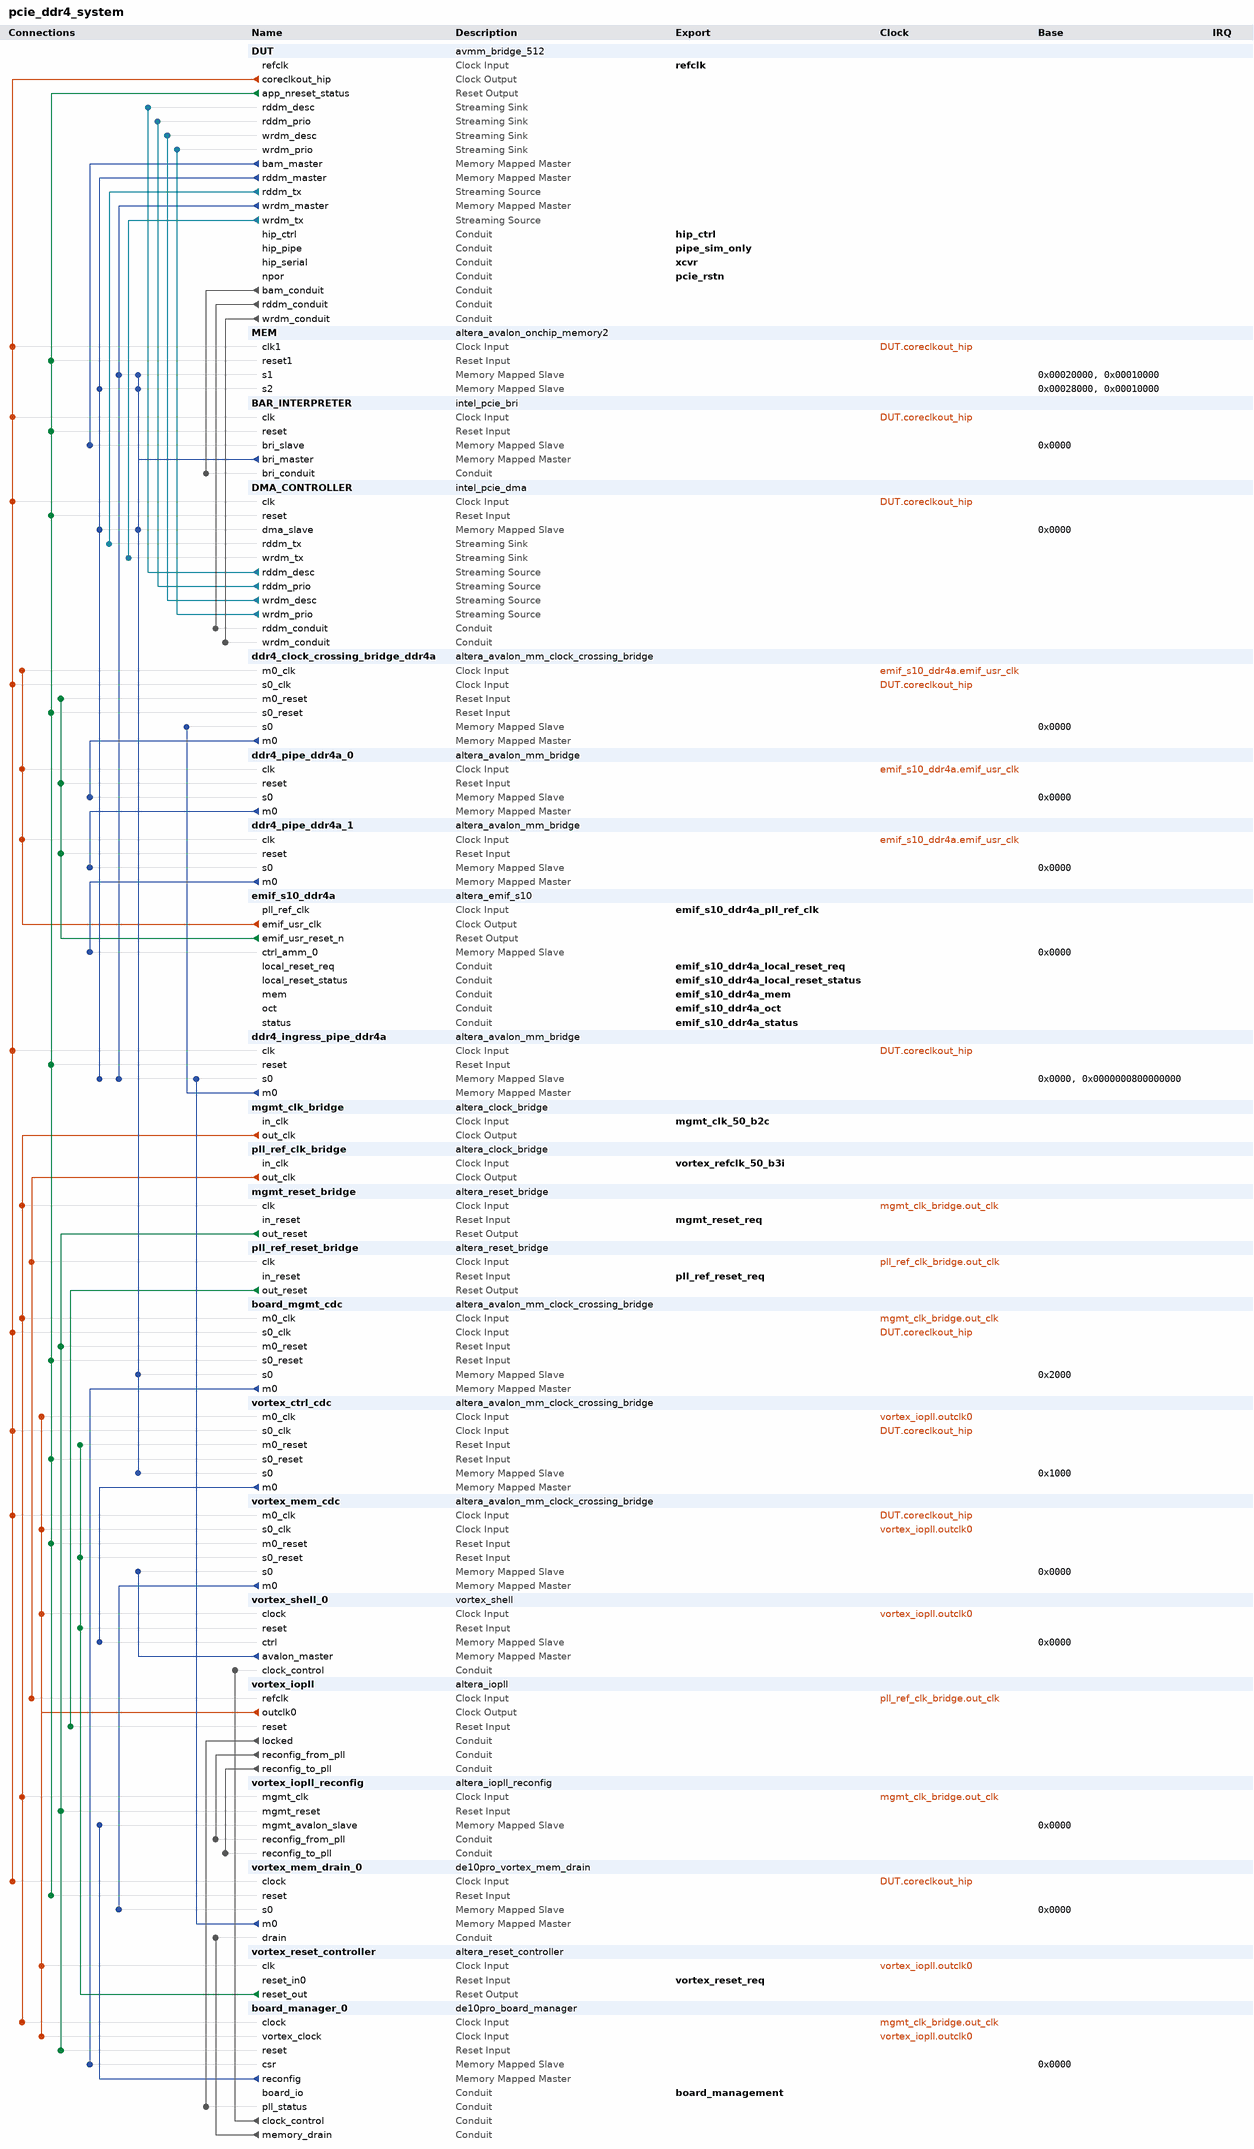
[diagram p0: system contents]
# Platform Designer (Qsys) system pcie_ddr4_system, Stratix 10 1SG280HU1F50E1VG
# Parameters at their usual value, and those the tool derives, are not listed.
package require -exact qsys 1.0
create_system pcie_ddr4_system
set_project_property DEVICE_FAMILY {Stratix 10}
set_project_property DEVICE 1SG280HU1F50E1VG

add_component DUT ip/pcie_example_design/pcie_example_design_DUT.ip avmm_bridge_512 DUT 19.1

add_component MEM ip/pcie_example_design/pcie_example_design_MEM.ip altera_avalon_onchip_memory2 MEM 19.1

add_component BAR_INTERPRETER ip/pcie_example_design/pcie_example_design_BAR_INTERPRETER.ip intel_pcie_bri BAR_INTERPRETER 19.1

add_component DMA_CONTROLLER ip/pcie_example_design/pcie_example_design_DMA_CONTROLLER.ip intel_pcie_dma DMA_CONTROLLER 19.1

add_component ddr4_clock_crossing_bridge_ddr4a ip/pcie_example_design/ddr4_clock_crossing_bridge.ip altera_avalon_mm_clock_crossing_bridge ddr4_clock_crossing_bridge_ddr4a 19.1

add_component ddr4_pipe_ddr4a_0 ip/pcie_example_design/ddr4_pipe.ip altera_avalon_mm_bridge ddr4_pipe_ddr4a_0 19.1

add_component ddr4_pipe_ddr4a_1 ip/pcie_example_design/ddr4_pipe.ip altera_avalon_mm_bridge ddr4_pipe_ddr4a_1 19.1

add_component emif_s10_ddr4a ip/pcie_example_design/emif_s10_ddr4a.ip altera_emif_s10 emif_s10_ddr4a 19.1.0

add_component ddr4_ingress_pipe_ddr4a ip/pcie_ddr4_system/pcie_ddr4_system_ddr4_ingress_pipe_ddr4a.ip altera_avalon_mm_bridge ddr4_ingress_pipe_ddr4a 19.1
load_component ddr4_ingress_pipe_ddr4a
set_component_parameter_value DATA_WIDTH 512
set_component_parameter_value ADDRESS_WIDTH 33
set_component_parameter_value USE_AUTO_ADDRESS_WIDTH 0
set_component_parameter_value ADDRESS_UNITS SYMBOLS
set_component_parameter_value MAX_BURST_SIZE 16
set_component_parameter_value MAX_PENDING_RESPONSES 128
set_component_parameter_value PIPELINE_RESPONSE 0
set_component_parameter_value SYNC_RESET 0
save_component

add_component mgmt_clk_bridge ip/pcie_ddr4_system/pcie_ddr4_system_mgmt_clk_bridge.ip altera_clock_bridge mgmt_clk_bridge 19.1
load_component mgmt_clk_bridge
set_component_parameter_value DERIVED_CLOCK_RATE 0
set_component_parameter_value EXPLICIT_CLOCK_RATE 50000000
save_component

add_component pll_ref_clk_bridge ip/pcie_ddr4_system/pcie_ddr4_system_pll_ref_clk_bridge.ip altera_clock_bridge pll_ref_clk_bridge 19.1
load_component pll_ref_clk_bridge
set_component_parameter_value DERIVED_CLOCK_RATE 0
set_component_parameter_value EXPLICIT_CLOCK_RATE 50000000
save_component

add_component mgmt_reset_bridge ip/pcie_ddr4_system/pcie_ddr4_system_mgmt_reset_bridge.ip altera_reset_bridge mgmt_reset_bridge 19.1
load_component mgmt_reset_bridge
set_component_parameter_value ACTIVE_LOW_RESET 0
set_component_parameter_value SYNCHRONOUS_EDGES deassert
set_component_parameter_value SYNC_RESET 0
save_component

add_component pll_ref_reset_bridge ip/pcie_ddr4_system/pcie_ddr4_system_pll_ref_reset_bridge.ip altera_reset_bridge pll_ref_reset_bridge 19.1
load_component pll_ref_reset_bridge
set_component_parameter_value ACTIVE_LOW_RESET 0
set_component_parameter_value SYNCHRONOUS_EDGES deassert
set_component_parameter_value SYNC_RESET 0
save_component

add_component board_mgmt_cdc ip/pcie_ddr4_system/pcie_ddr4_system_board_mgmt_cdc.ip altera_avalon_mm_clock_crossing_bridge board_mgmt_cdc 19.1
load_component board_mgmt_cdc
set_component_parameter_value DATA_WIDTH 32
set_component_parameter_value ADDRESS_WIDTH 8
set_component_parameter_value USE_AUTO_ADDRESS_WIDTH 0
set_component_parameter_value MAX_BURST_SIZE 1
set_component_parameter_value COMMAND_FIFO_DEPTH 4
set_component_parameter_value RESPONSE_FIFO_DEPTH 4
set_component_parameter_value MASTER_SYNC_DEPTH 2
set_component_parameter_value SLAVE_SYNC_DEPTH 2
set_component_parameter_value SYNC_RESET 0
save_component

add_component vortex_ctrl_cdc ip/pcie_ddr4_system/pcie_ddr4_system_vortex_ctrl_cdc.ip altera_avalon_mm_clock_crossing_bridge vortex_ctrl_cdc 19.1
load_component vortex_ctrl_cdc
set_component_parameter_value DATA_WIDTH 32
set_component_parameter_value ADDRESS_WIDTH 12
set_component_parameter_value USE_AUTO_ADDRESS_WIDTH 0
set_component_parameter_value MAX_BURST_SIZE 1
set_component_parameter_value COMMAND_FIFO_DEPTH 4
set_component_parameter_value RESPONSE_FIFO_DEPTH 4
set_component_parameter_value MASTER_SYNC_DEPTH 2
set_component_parameter_value SLAVE_SYNC_DEPTH 2
set_component_parameter_value SYNC_RESET 0
save_component

add_component vortex_mem_cdc ip/pcie_ddr4_system/pcie_ddr4_system_vortex_mem_cdc.ip altera_avalon_mm_clock_crossing_bridge vortex_mem_cdc 19.1
load_component vortex_mem_cdc
set_component_parameter_value DATA_WIDTH 512
set_component_parameter_value ADDRESS_WIDTH 33
set_component_parameter_value USE_AUTO_ADDRESS_WIDTH 0
set_component_parameter_value MAX_BURST_SIZE 16
set_component_parameter_value COMMAND_FIFO_DEPTH 32
set_component_parameter_value RESPONSE_FIFO_DEPTH 512
set_component_parameter_value MASTER_SYNC_DEPTH 2
set_component_parameter_value SLAVE_SYNC_DEPTH 2
set_component_parameter_value SYNC_RESET 0
save_component

add_component vortex_shell_0 ip/pcie_ddr4_system/pcie_ddr4_system_vortex_shell_0.ip vortex_shell vortex_shell_0 1.0
load_component vortex_shell_0
set_component_parameter_value C_CTRL_ADDR_WIDTH 20
set_component_parameter_value C_CTRL_DATA_WIDTH 32
set_component_parameter_value C_MEM_ADDR_WIDTH 33
set_component_parameter_value C_MEM_DATA_WIDTH 512
set_component_parameter_value C_MEM_BURST_WIDTH 5
save_component

add_component vortex_iopll ip/pcie_ddr4_system/pcie_ddr4_system_vortex_iopll.ip altera_iopll vortex_iopll 19.1
load_component vortex_iopll
set_component_parameter_value gui_device_family {Stratix 10}
set_component_parameter_value gui_device_component 1SG280HU1F50E1VG
set_component_parameter_value gui_device_speed_grade 1
set_component_parameter_value gui_debug_mode false
set_component_parameter_value gui_skip_sdc_generation false
set_component_parameter_value gui_include_iossm false
set_component_parameter_value gui_cal_code_hex_file iossm.hex
set_component_parameter_value gui_parameter_table_hex_file seq_params_sim.hex
set_component_parameter_value gui_pll_tclk_mux_en false
set_component_parameter_value gui_pll_tclk_sel pll_tclk_m_src
set_component_parameter_value gui_pll_vco_freq_band_0 pll_freq_clk0_disabled
set_component_parameter_value gui_pll_freqcal_en true
set_component_parameter_value gui_pll_freqcal_req_flag true
set_component_parameter_value gui_cal_converge false
set_component_parameter_value gui_cal_error cal_clean
set_component_parameter_value gui_pll_cal_done false
set_component_parameter_value gui_pll_type S10_Simple
set_component_parameter_value gui_pll_m_cnt_in_src c_m_cnt_in_src_ph_mux_clk
set_component_parameter_value gui_c_cnt_in_src0 c_m_cnt_in_src_ph_mux_clk
set_component_parameter_value system_info_device_family {Stratix 10}
set_component_parameter_value system_info_device_component 1SG280HU1F50E1VG
set_component_parameter_value system_info_device_speed_grade 1
set_component_parameter_value system_part_trait_speed_grade 1
set_component_parameter_value gui_usr_device_speed_grade 1
set_component_parameter_value gui_en_reconf true
set_component_parameter_value gui_location_type {I/O Bank}
set_component_parameter_value gui_use_logical false
set_component_parameter_value gui_reference_clock_frequency 50.0
set_component_parameter_value gui_reference_clock_frequency_ps 10000.0
set_component_parameter_value gui_use_coreclk false
set_component_parameter_value gui_refclk_might_change false
set_component_parameter_value gui_prot_mode UNUSED
set_component_parameter_value gui_use_locked true
set_component_parameter_value gui_lock_setting {Low Lock Time}
set_component_parameter_value gui_en_lvds_ports Disabled
set_component_parameter_value gui_operation_mode direct
set_component_parameter_value gui_clock_to_compensate 0
set_component_parameter_value gui_use_NDFB_modes false
set_component_parameter_value gui_number_of_clocks 1
set_component_parameter_value gui_fixed_vco_frequency_ps 1667.0
set_component_parameter_value gui_vco_frequency 600.0
set_component_parameter_value gui_mif_gen_options {Add Configuration to Existing MIF File}
set_component_parameter_value gui_new_mif_file_path generated/dynclk/vortex_iopll_profiles.mif
set_component_parameter_value gui_existing_mif_file_path generated/dynclk/vortex_iopll_profiles.mif
set_component_parameter_value gui_mif_config_name f250
set_component_parameter_value gui_enable_permit_cal false
set_component_parameter_value gui_clock_name_global false
set_component_parameter_value gui_output_clock_frequency0 250.0
set_component_parameter_value gui_output_clock_frequency_ps0 10000.0
set_component_parameter_value gui_actual_output_clock_frequency0 250.0
set_component_parameter_value gui_actual_output_clock_frequency_range0 247.916667,248.0,248.333333,250.0,251.666667,252.0
set_component_parameter_value gui_actual_phase_shift0 0.0
set_component_parameter_value gui_actual_phase_shift_range0 0.0,83.3,100.0,125.0,166.7,200.0
set_component_parameter_value gui_actual_phase_shift_deg0 0.0
set_component_parameter_value gui_actual_phase_shift_deg_range0 0.0,7.5,9.0,11.2,15.0,18.0
set_component_parameter_value gui_actual_duty_cycle0 50.0
set_component_parameter_value gui_actual_duty_cycle_range0 37.5,40.0,41.67,50.0,58.33,60.0
set_component_parameter_value parameterTable_names {M-Counter Divide Setting,N-Counter Divide Setting,VCO Frequency,C-Counter-0 Divide Setting,C-Counter-1 Divide Setting,C-Counter-2 Divide Setting,C-Counter-3 Divide Setting,C-Counter-4 Divide Setting,C-Counter-5 Divide Setting,C-Counter-6 Divide Setting,C-Counter-7 Divide Setting,C-Counter-8 Divide Setting,PLL Auto Reset,M-Counter Hi Divide,M-Counter Lo Divide,M-Counter Even Duty Enable,M-Counter Bypass Enable,N-Counter Hi Divide,N-Counter Lo Divide,N-Counter Even Duty Enable,N-Counter Bypass Enable,C-Counter-0 Hi Divide,C-Counter-1 Hi Divide,C-Counter-2 Hi Divide,C-Counter-3 Hi Divide,C-Counter-4 Hi Divide,C-Counter-5 Hi Divide,C-Counter-6 Hi Divide,C-Counter-7 Hi Divide,C-Counter-8 Hi Divide,C-Counter-0 Lo Divide,C-Counter-1 Lo Divide,C-Counter-2 Lo Divide,C-Counter-3 Lo Divide,C-Counter-4 Lo Divide,C-Counter-5 Lo Divide,C-Counter-6 Lo Divide,C-Counter-7 Lo Divide,C-Counter-8 Lo Divide,C-Counter-0 Even Duty Enable,C-Counter-1 Even Duty Enable,C-Counter-2 Even Duty Enable,C-Counter-3 Even Duty Enable,C-Counter-4 Even Duty Enable,C-Counter-5 Even Duty Enable,C-Counter-6 Even Duty Enable,C-Counter-7 Even Duty Enable,C-Counter-8 Even Duty Enable,C-Counter-0 Bypass Enable,C-Counter-1 Bypass Enable,C-Counter-2 Bypass Enable,C-Counter-3 Bypass Enable,C-Counter-4 Bypass Enable,C-Counter-5 Bypass Enable,C-Counter-6 Bypass Enable,C-Counter-7 Bypass Enable,C-Counter-8 Bypass Enable,C-Counter-0 Preset,C-Counter-1 Preset,C-Counter-2 Preset,C-Counter-3 Preset,C-Counter-4 Preset,C-Counter-5 Preset,C-Counter-6 Preset,C-Counter-7 Preset,C-Counter-8 Preset,C-Counter-0 Phase Mux Preset,C-Counter-1 Phase Mux Preset,C-Counter-2 Phase Mux Preset,C-Counter-3 Phase Mux Preset,C-Counter-4 Phase Mux Preset,C-Counter-5 Phase Mux Preset,C-Counter-6 Phase Mux Preset,C-Counter-7 Phase Mux Preset,C-Counter-8 Phase Mux Preset,Charge Pump Current,Bandwidth Control}
set_component_parameter_value parameterTable_values {30,1,1500.0 MHz,6,1,1,1,1,1,1,1,1,false,15,15,false,false,256,256,false,true,3,256,256,256,256,256,256,256,256,3,256,256,256,256,256,256,256,256,false,false,false,false,false,false,false,false,false,false,true,true,true,true,true,true,true,true,1,1,1,1,1,1,1,1,1,0,0,0,0,0,0,0,0,0,pll_cp_setting4,pll_bw_res_setting4}
set_component_parameter_value mifTable_values ,4,192,16,,,256,1,0,256,16,0,0,0,16,4,0,4,8,0,0,8,256,1,0,256,256,1,0,256,256,1,0,256,256,1,0,256,256,1,0,256,256,1,0,256,256,1,0,256,256,1,0,256,47,f100,,,256,1,0,256,15,0,0,0,15,4,0,4,6,0,0,6,256,1,0,256,256,1,0,256,256,1,0,256,256,1,0,256,256,1,0,256,256,1,0,256,256,1,0,256,256,1,0,256,47,f125,,,256,1,0,256,16,0,0,0,16,4,0,4,4,0,0,4,256,1,0,256,256,1,0,256,256,1,0,256,256,1,0,256,256,1,0,256,256,1,0,256,256,1,0,256,256,1,0,256,47,f200,,,256,1,0,256,15,0,0,0,15,4,0,4,3,0,0,3,256,1,0,256,256,1,0,256,256,1,0,256,256,1,0,256,256,1,0,256,256,1,0,256,256,1,0,256,256,1,0,256,47,f250
set_component_parameter_value pll_m_cnt_basic 1
set_component_parameter_value pll_m_cnt 1
set_component_parameter_value prot_mode BASIC
set_component_parameter_value m_cnt_hi_div 15
set_component_parameter_value eff_m_cnt 1
set_component_parameter_value multiply_factor 30
set_component_parameter_value use_core_refclk false
set_component_parameter_value m_cnt_lo_div 15
set_component_parameter_value n_cnt_hi_div 256
set_component_parameter_value n_cnt_lo_div 256
set_component_parameter_value m_cnt_bypass_en false
set_component_parameter_value n_cnt_bypass_en true
set_component_parameter_value m_cnt_odd_div_duty_en false
set_component_parameter_value n_cnt_odd_div_duty_en false
set_component_parameter_value pll_vco_div 1
set_component_parameter_value pll_cp_current pll_cp_setting4
set_component_parameter_value pll_bwctrl pll_bw_res_setting4
set_component_parameter_value pll_ripplecap_ctrl pll_ripplecap_setting0
set_component_parameter_value pll_fractional_division 1
set_component_parameter_value fractional_vco_multiplier false
set_component_parameter_value reference_clock_frequency {50.0 MHz}
set_component_parameter_value pll_fractional_cout 1
set_component_parameter_value pll_dsm_out_sel 1st_order
set_component_parameter_value operation_mode direct
set_component_parameter_value number_of_clocks 1
set_component_parameter_value number_of_outclks 1
set_component_parameter_value pll_vcoph_div 1
set_component_parameter_value pll_type S10_Physical
set_component_parameter_value pll_subtype Reconfigurable
set_component_parameter_value pll_output_clk_frequency {1500.0 MHz}
set_component_parameter_value pll_pfd_frequency {50.0 MHz}
set_component_parameter_value mimic_fbclk_type gclk
set_component_parameter_value pll_bw_sel low_bw
set_component_parameter_value pll_slf_rst false
set_component_parameter_value pll_fbclk_mux_1 pll_fbclk_mux_1_glb
set_component_parameter_value pll_fbclk_mux_2 pll_fbclk_mux_2_m_cnt
set_component_parameter_value pll_m_cnt_in_src c_m_cnt_in_src_ph_mux_clk
set_component_parameter_value pll_clkin_0_src clk_0
set_component_parameter_value refclk1_frequency {100.0 MHz}
set_component_parameter_value pll_clk_loss_sw_en false
set_component_parameter_value pll_manu_clk_sw_en false
set_component_parameter_value pll_auto_clk_sw_en false
set_component_parameter_value pll_clkin_1_src clk_0
set_component_parameter_value pll_clk_sw_dly 0
set_component_parameter_value pll_extclk_0_cnt_src pll_extclk_cnt_src_vss
set_component_parameter_value pll_extclk_1_cnt_src pll_extclk_cnt_src_vss
set_component_parameter_value pll_lock_fltr_cfg 100
set_component_parameter_value pll_unlock_fltr_cfg 2
set_component_parameter_value lock_mode low_lock_time
set_component_parameter_value clock_to_compensate 0
set_component_parameter_value clock_name_global false
set_component_parameter_value pll_freqcal_en true
set_component_parameter_value pll_defer_cal_user_mode false
set_component_parameter_value dprio_interface_sel 3
set_component_parameter_value merging_permitted false
set_component_parameter_value c_cnt_hi_div0 3
set_component_parameter_value c_cnt_hi_div1 256
set_component_parameter_value c_cnt_hi_div2 256
set_component_parameter_value c_cnt_hi_div3 256
set_component_parameter_value c_cnt_hi_div4 256
set_component_parameter_value c_cnt_hi_div5 256
set_component_parameter_value c_cnt_hi_div6 256
set_component_parameter_value c_cnt_hi_div7 256
set_component_parameter_value c_cnt_hi_div8 256
set_component_parameter_value c_cnt_hi_div9 1
set_component_parameter_value c_cnt_hi_div10 1
set_component_parameter_value c_cnt_hi_div11 1
set_component_parameter_value c_cnt_hi_div12 1
set_component_parameter_value c_cnt_hi_div13 1
set_component_parameter_value c_cnt_hi_div14 1
set_component_parameter_value c_cnt_hi_div15 1
set_component_parameter_value c_cnt_hi_div16 1
set_component_parameter_value c_cnt_hi_div17 1
set_component_parameter_value c_cnt_lo_div0 3
set_component_parameter_value c_cnt_lo_div1 256
set_component_parameter_value c_cnt_lo_div2 256
set_component_parameter_value c_cnt_lo_div3 256
set_component_parameter_value c_cnt_lo_div4 256
set_component_parameter_value c_cnt_lo_div5 256
set_component_parameter_value c_cnt_lo_div6 256
set_component_parameter_value c_cnt_lo_div7 256
set_component_parameter_value c_cnt_lo_div8 256
set_component_parameter_value c_cnt_lo_div9 1
set_component_parameter_value c_cnt_lo_div10 1
set_component_parameter_value c_cnt_lo_div11 1
set_component_parameter_value c_cnt_lo_div12 1
set_component_parameter_value c_cnt_lo_div13 1
set_component_parameter_value c_cnt_lo_div14 1
set_component_parameter_value c_cnt_lo_div15 1
set_component_parameter_value c_cnt_lo_div16 1
set_component_parameter_value c_cnt_lo_div17 1
set_component_parameter_value c_cnt_prst0 1
set_component_parameter_value c_cnt_prst1 1
set_component_parameter_value c_cnt_prst2 1
set_component_parameter_value c_cnt_prst3 1
set_component_parameter_value c_cnt_prst4 1
set_component_parameter_value c_cnt_prst5 1
set_component_parameter_value c_cnt_prst6 1
set_component_parameter_value c_cnt_prst7 1
set_component_parameter_value c_cnt_prst8 1
set_component_parameter_value c_cnt_prst9 1
set_component_parameter_value c_cnt_prst10 1
set_component_parameter_value c_cnt_prst11 1
set_component_parameter_value c_cnt_prst12 1
set_component_parameter_value c_cnt_prst13 1
set_component_parameter_value c_cnt_prst14 1
set_component_parameter_value c_cnt_prst15 1
set_component_parameter_value c_cnt_prst16 1
set_component_parameter_value c_cnt_prst17 1
set_component_parameter_value c_cnt_ph_mux_prst0 0
set_component_parameter_value c_cnt_ph_mux_prst1 0
set_component_parameter_value c_cnt_ph_mux_prst2 0
set_component_parameter_value c_cnt_ph_mux_prst3 0
set_component_parameter_value c_cnt_ph_mux_prst4 0
set_component_parameter_value c_cnt_ph_mux_prst5 0
set_component_parameter_value c_cnt_ph_mux_prst6 0
set_component_parameter_value c_cnt_ph_mux_prst7 0
set_component_parameter_value c_cnt_ph_mux_prst8 0
set_component_parameter_value c_cnt_ph_mux_prst9 0
set_component_parameter_value c_cnt_ph_mux_prst10 0
set_component_parameter_value c_cnt_ph_mux_prst11 0
set_component_parameter_value c_cnt_ph_mux_prst12 0
set_component_parameter_value c_cnt_ph_mux_prst13 0
set_component_parameter_value c_cnt_ph_mux_prst14 0
set_component_parameter_value c_cnt_ph_mux_prst15 0
set_component_parameter_value c_cnt_ph_mux_prst16 0
set_component_parameter_value c_cnt_ph_mux_prst17 0
set_component_parameter_value c_cnt_in_src0 c_m_cnt_in_src_ph_mux_clk
set_component_parameter_value c_cnt_in_src1 c_m_cnt_in_src_ph_mux_clk
set_component_parameter_value c_cnt_in_src2 c_m_cnt_in_src_ph_mux_clk
set_component_parameter_value c_cnt_in_src3 c_m_cnt_in_src_ph_mux_clk
set_component_parameter_value c_cnt_in_src4 c_m_cnt_in_src_ph_mux_clk
set_component_parameter_value c_cnt_in_src5 c_m_cnt_in_src_ph_mux_clk
set_component_parameter_value c_cnt_in_src6 c_m_cnt_in_src_ph_mux_clk
set_component_parameter_value c_cnt_in_src7 c_m_cnt_in_src_ph_mux_clk
set_component_parameter_value c_cnt_in_src8 c_m_cnt_in_src_ph_mux_clk
set_component_parameter_value c_cnt_in_src9 c_m_cnt_in_src_ph_mux_clk
set_component_parameter_value c_cnt_in_src10 c_m_cnt_in_src_ph_mux_clk
set_component_parameter_value c_cnt_in_src11 c_m_cnt_in_src_ph_mux_clk
set_component_parameter_value c_cnt_in_src12 c_m_cnt_in_src_ph_mux_clk
set_component_parameter_value c_cnt_in_src13 c_m_cnt_in_src_ph_mux_clk
set_component_parameter_value c_cnt_in_src14 c_m_cnt_in_src_ph_mux_clk
set_component_parameter_value c_cnt_in_src15 c_m_cnt_in_src_ph_mux_clk
set_component_parameter_value c_cnt_in_src16 c_m_cnt_in_src_ph_mux_clk
set_component_parameter_value c_cnt_in_src17 c_m_cnt_in_src_ph_mux_clk
set_component_parameter_value c_cnt_bypass_en0 false
set_component_parameter_value c_cnt_bypass_en1 true
set_component_parameter_value c_cnt_bypass_en2 true
set_component_parameter_value c_cnt_bypass_en3 true
set_component_parameter_value c_cnt_bypass_en4 true
set_component_parameter_value c_cnt_bypass_en5 true
set_component_parameter_value c_cnt_bypass_en6 true
set_component_parameter_value c_cnt_bypass_en7 true
set_component_parameter_value c_cnt_bypass_en8 true
set_component_parameter_value c_cnt_bypass_en9 true
set_component_parameter_value c_cnt_bypass_en10 true
set_component_parameter_value c_cnt_bypass_en11 true
set_component_parameter_value c_cnt_bypass_en12 true
set_component_parameter_value c_cnt_bypass_en13 true
set_component_parameter_value c_cnt_bypass_en14 true
set_component_parameter_value c_cnt_bypass_en15 true
set_component_parameter_value c_cnt_bypass_en16 true
set_component_parameter_value c_cnt_bypass_en17 true
set_component_parameter_value c_cnt_odd_div_duty_en0 false
set_component_parameter_value c_cnt_odd_div_duty_en1 false
set_component_parameter_value c_cnt_odd_div_duty_en2 false
set_component_parameter_value c_cnt_odd_div_duty_en3 false
set_component_parameter_value c_cnt_odd_div_duty_en4 false
set_component_parameter_value c_cnt_odd_div_duty_en5 false
set_component_parameter_value c_cnt_odd_div_duty_en6 false
set_component_parameter_value c_cnt_odd_div_duty_en7 false
set_component_parameter_value c_cnt_odd_div_duty_en8 false
set_component_parameter_value c_cnt_odd_div_duty_en9 false
set_component_parameter_value c_cnt_odd_div_duty_en10 false
set_component_parameter_value c_cnt_odd_div_duty_en11 false
set_component_parameter_value c_cnt_odd_div_duty_en12 false
set_component_parameter_value c_cnt_odd_div_duty_en13 false
set_component_parameter_value c_cnt_odd_div_duty_en14 false
set_component_parameter_value c_cnt_odd_div_duty_en15 false
set_component_parameter_value c_cnt_odd_div_duty_en16 false
set_component_parameter_value c_cnt_odd_div_duty_en17 false
set_component_parameter_value output_clock_frequency0 {250.0 MHz}
set_component_parameter_value output_clock_frequency1 {0 ps}
set_component_parameter_value output_clock_frequency2 {0 ps}
set_component_parameter_value output_clock_frequency3 {0 ps}
set_component_parameter_value output_clock_frequency4 {0 ps}
set_component_parameter_value output_clock_frequency5 {0 ps}
set_component_parameter_value output_clock_frequency6 {0 ps}
set_component_parameter_value output_clock_frequency7 {0 ps}
set_component_parameter_value output_clock_frequency8 {0 ps}
set_component_parameter_value output_clock_frequency9 {0 MHz}
set_component_parameter_value output_clock_frequency10 {0 MHz}
set_component_parameter_value output_clock_frequency11 {0 MHz}
set_component_parameter_value output_clock_frequency12 {0 MHz}
set_component_parameter_value output_clock_frequency13 {0 MHz}
set_component_parameter_value output_clock_frequency14 {0 MHz}
set_component_parameter_value output_clock_frequency15 {0 MHz}
set_component_parameter_value output_clock_frequency16 {0 MHz}
set_component_parameter_value output_clock_frequency17 {0 MHz}
set_component_parameter_value phase_shift0 {0 ps}
set_component_parameter_value phase_shift1 {0 ps}
set_component_parameter_value phase_shift2 {0 ps}
set_component_parameter_value phase_shift3 {0 ps}
set_component_parameter_value phase_shift4 {0 ps}
set_component_parameter_value phase_shift5 {0 ps}
set_component_parameter_value phase_shift6 {0 ps}
set_component_parameter_value phase_shift7 {0 ps}
set_component_parameter_value phase_shift8 {0 ps}
set_component_parameter_value phase_shift9 {0 ps}
set_component_parameter_value phase_shift10 {0 ps}
set_component_parameter_value phase_shift11 {0 ps}
set_component_parameter_value phase_shift12 {0 ps}
set_component_parameter_value phase_shift13 {0 ps}
set_component_parameter_value phase_shift14 {0 ps}
set_component_parameter_value phase_shift15 {0 ps}
set_component_parameter_value phase_shift16 {0 ps}
set_component_parameter_value phase_shift17 {0 ps}
set_component_parameter_value duty_cycle0 50
set_component_parameter_value duty_cycle1 50
set_component_parameter_value duty_cycle2 50
set_component_parameter_value duty_cycle3 50
set_component_parameter_value duty_cycle4 50
set_component_parameter_value duty_cycle5 50
set_component_parameter_value duty_cycle6 50
set_component_parameter_value duty_cycle7 50
set_component_parameter_value duty_cycle8 50
set_component_parameter_value duty_cycle9 50
set_component_parameter_value duty_cycle10 50
set_component_parameter_value duty_cycle11 50
set_component_parameter_value duty_cycle12 50
set_component_parameter_value duty_cycle13 50
set_component_parameter_value duty_cycle14 50
set_component_parameter_value duty_cycle15 50
set_component_parameter_value duty_cycle16 50
set_component_parameter_value duty_cycle17 50
set_component_parameter_value clock_name_0 outclk0
set_component_parameter_value clock_name_global_0 false
set_component_parameter_value clock_name_global_1 false
set_component_parameter_value clock_name_global_2 false
set_component_parameter_value clock_name_global_3 false
set_component_parameter_value clock_name_global_4 false
set_component_parameter_value clock_name_global_5 false
set_component_parameter_value clock_name_global_6 false
set_component_parameter_value clock_name_global_7 false
set_component_parameter_value clock_name_global_8 false
set_component_parameter_value divide_factor0 1
set_component_parameter_value divide_factor1 1
set_component_parameter_value divide_factor2 1
set_component_parameter_value divide_factor3 1
set_component_parameter_value divide_factor4 1
set_component_parameter_value divide_factor5 1
set_component_parameter_value divide_factor6 1
set_component_parameter_value divide_factor7 1
set_component_parameter_value divide_factor8 1
set_component_parameter_value pll_tclk_mux_en false
set_component_parameter_value pll_tclk_sel pll_tclk_m_src
set_component_parameter_value pll_vco_freq_band_0 pll_freq_clk0_disabled
set_component_parameter_value pll_vco_freq_band_1 pll_freq_clk1_disabled
set_component_parameter_value pll_freqcal_req_flag true
set_component_parameter_value cal_converge false
set_component_parameter_value cal_error cal_clean
set_component_parameter_value pll_cal_done false
set_component_parameter_value include_iossm false
set_component_parameter_value cal_code_hex_file iossm.hex
set_component_parameter_value parameter_table_hex_file seq_params_sim.hex
set_component_parameter_value iossm_nios_sim_clk_period_ps 1333
set_component_parameter_value hp_number_of_family_allowable_clocks 9
set_component_parameter_value hp_previous_num_clocks 1
set_component_parameter_value hp_actual_vco_frequency_fp 600.0
set_component_parameter_value hp_qsys_scripting_mode true
set_component_parameter_value hp_actual_output_clock_frequency_fp0 250.0
set_component_parameter_value hp_actual_output_clock_frequency_fp1 100.0
set_component_parameter_value hp_actual_output_clock_frequency_fp2 100.0
set_component_parameter_value hp_actual_output_clock_frequency_fp3 100.0
set_component_parameter_value hp_actual_output_clock_frequency_fp4 100.0
set_component_parameter_value hp_actual_output_clock_frequency_fp5 100.0
set_component_parameter_value hp_actual_output_clock_frequency_fp6 100.0
set_component_parameter_value hp_actual_output_clock_frequency_fp7 100.0
set_component_parameter_value hp_actual_output_clock_frequency_fp8 100.0
set_component_parameter_value hp_actual_output_clock_frequency_fp9 100.0
set_component_parameter_value hp_actual_output_clock_frequency_fp10 100.0
set_component_parameter_value hp_actual_output_clock_frequency_fp11 100.0
set_component_parameter_value hp_actual_output_clock_frequency_fp12 100.0
set_component_parameter_value hp_actual_output_clock_frequency_fp13 100.0
set_component_parameter_value hp_actual_output_clock_frequency_fp14 100.0
set_component_parameter_value hp_actual_output_clock_frequency_fp15 100.0
set_component_parameter_value hp_actual_output_clock_frequency_fp16 100.0
set_component_parameter_value hp_actual_output_clock_frequency_fp17 100.0
set_component_parameter_value hp_actual_phase_shift_fp0 0.0
set_component_parameter_value hp_actual_phase_shift_fp1 0.0
set_component_parameter_value hp_actual_phase_shift_fp2 0.0
set_component_parameter_value hp_actual_phase_shift_fp3 0.0
set_component_parameter_value hp_actual_phase_shift_fp4 0.0
set_component_parameter_value hp_actual_phase_shift_fp5 0.0
set_component_parameter_value hp_actual_phase_shift_fp6 0.0
set_component_parameter_value hp_actual_phase_shift_fp7 0.0
set_component_parameter_value hp_actual_phase_shift_fp8 0.0
set_component_parameter_value hp_actual_phase_shift_fp9 0.0
set_component_parameter_value hp_actual_phase_shift_fp10 0.0
set_component_parameter_value hp_actual_phase_shift_fp11 0.0
set_component_parameter_value hp_actual_phase_shift_fp12 0.0
set_component_parameter_value hp_actual_phase_shift_fp13 0.0
set_component_parameter_value hp_actual_phase_shift_fp14 0.0
set_component_parameter_value hp_actual_phase_shift_fp15 0.0
set_component_parameter_value hp_actual_phase_shift_fp16 0.0
set_component_parameter_value hp_actual_phase_shift_fp17 0.0
set_component_parameter_value hp_actual_duty_cycle_fp0 50.0
set_component_parameter_value hp_actual_duty_cycle_fp1 50.0
set_component_parameter_value hp_actual_duty_cycle_fp2 50.0
set_component_parameter_value hp_actual_duty_cycle_fp3 50.0
set_component_parameter_value hp_actual_duty_cycle_fp4 50.0
set_component_parameter_value hp_actual_duty_cycle_fp5 50.0
set_component_parameter_value hp_actual_duty_cycle_fp6 50.0
set_component_parameter_value hp_actual_duty_cycle_fp7 50.0
set_component_parameter_value hp_actual_duty_cycle_fp8 50.0
set_component_parameter_value hp_actual_duty_cycle_fp9 50.0
set_component_parameter_value hp_actual_duty_cycle_fp10 50.0
set_component_parameter_value hp_actual_duty_cycle_fp11 50.0
set_component_parameter_value hp_actual_duty_cycle_fp12 50.0
set_component_parameter_value hp_actual_duty_cycle_fp13 50.0
set_component_parameter_value hp_actual_duty_cycle_fp14 50.0
set_component_parameter_value hp_actual_duty_cycle_fp15 50.0
set_component_parameter_value hp_actual_duty_cycle_fp16 50.0
set_component_parameter_value hp_actual_duty_cycle_fp17 50.0
save_component

add_component vortex_iopll_reconfig ip/pcie_ddr4_system/pcie_ddr4_system_vortex_iopll_reconfig_0.ip altera_iopll_reconfig vortex_iopll_reconfig 19.1
load_component vortex_iopll_reconfig
set_component_parameter_value device_family {Stratix 10}
set_component_parameter_value gui_device_family {Stratix 10}
set_component_parameter_value gui_advanced_reconfig false
set_component_parameter_value gui_cal_mode false
set_component_parameter_value gui_avalon_addr_width 10
set_component_parameter_value gui_reconfig_mif_filename generated/dynclk/vortex_iopll_profiles.mif
set_component_parameter_value gui_wait_for_lock true
set_component_parameter_value validated_mif_filename generated/dynclk/vortex_iopll_profiles.mif
set_component_parameter_value gui_copy_mif true
set_component_parameter_value SHIFT_REGISTER_DEPTH 0
set_component_parameter_value DPRIO_ADDR_WIDTH 8
set_component_parameter_value DPRIO_DATA_WIDTH 8
set_component_parameter_value DPRIO_MODE_SEL_WIDTH 2
set_component_parameter_value ROM_ADDR_WIDTH 8
set_component_parameter_value ROM_DATA_WIDTH 16
set_component_parameter_value ROM_NUM_WORDS 192
set_component_parameter_value TO_PLL_WIDTH 30
set_component_parameter_value FROM_PLL_WIDTH 11
set_component_parameter_value DPRIO_GATING_ADDR 22
set_component_parameter_value MIF_EOF 65535
set_component_parameter_value WAIT_FOR_LOCK true
set_component_parameter_value AVALON_ADDR_TIEOFF_WIDTH 0
set_component_parameter_value reconfig_mif_filename validated_iopll_configurations.mif
set_component_parameter_value ADVANCED_RECONFIG false
set_component_parameter_value MIF_ADDRESS_0 0
set_component_parameter_value MIF_ADDRESS_1 48
set_component_parameter_value MIF_ADDRESS_2 96
set_component_parameter_value MIF_ADDRESS_3 144
set_component_parameter_value MIF_ADDRESS_4 0
set_component_parameter_value MIF_ADDRESS_5 0
set_component_parameter_value MIF_ADDRESS_6 0
set_component_parameter_value MIF_ADDRESS_7 0
set_component_parameter_value MIF_ADDRESS_8 0
set_component_parameter_value MIF_ADDRESS_9 0
set_component_parameter_value MIF_ADDRESS_10 0
set_component_parameter_value MIF_ADDRESS_11 0
set_component_parameter_value MIF_ADDRESS_12 0
set_component_parameter_value MIF_ADDRESS_13 0
set_component_parameter_value MIF_ADDRESS_14 0
set_component_parameter_value MIF_ADDRESS_15 0
set_component_parameter_value MIF_ADDRESS_16 0
set_component_parameter_value MIF_ADDRESS_17 0
set_component_parameter_value MIF_ADDRESS_18 0
set_component_parameter_value MIF_ADDRESS_19 0
set_component_parameter_value MIF_ADDRESS_20 0
set_component_parameter_value MIF_ADDRESS_21 0
set_component_parameter_value MIF_ADDRESS_22 0
set_component_parameter_value MIF_ADDRESS_23 0
set_component_parameter_value MIF_ADDRESS_24 0
set_component_parameter_value MIF_ADDRESS_25 0
set_component_parameter_value MIF_ADDRESS_26 0
set_component_parameter_value MIF_ADDRESS_27 0
set_component_parameter_value MIF_ADDRESS_28 0
set_component_parameter_value MIF_ADDRESS_29 0
set_component_parameter_value MIF_ADDRESS_30 0
set_component_parameter_value MIF_ADDRESS_31 0
set_component_parameter_value debug_mode false
set_component_parameter_value table_values ,4,192,15,,,256,1,0,256,16,0,0,0,16,4,0,4,8,0,0,8,256,1,0,256,256,1,0,256,256,1,0,256,256,1,0,256,256,1,0,256,256,1,0,256,256,1,0,256,256,1,0,256,47,f100,,,256,1,0,256,15,0,0,0,15,4,0,4,6,0,0,6,256,1,0,256,256,1,0,256,256,1,0,256,256,1,0,256,256,1,0,256,256,1,0,256,256,1,0,256,256,1,0,256,47,f125,,,256,1,0,256,16,0,0,0,16,4,0,4,4,0,0,4,256,1,0,256,256,1,0,256,256,1,0,256,256,1,0,256,256,1,0,256,256,1,0,256,256,1,0,256,256,1,0,256,47,f200,,,256,1,0,256,15,0,0,0,15,4,0,4,3,0,0,3,256,1,0,256,256,1,0,256,256,1,0,256,256,1,0,256,256,1,0,256,256,1,0,256,256,1,0,256,256,1,0,256,47,f250
save_component

add_component vortex_mem_drain_0 ip/pcie_ddr4_system/pcie_ddr4_system_vortex_mem_drain_0.ip de10pro_vortex_mem_drain vortex_mem_drain_0 1.0
load_component vortex_mem_drain_0
set_component_parameter_value ADDRESS_WIDTH 33
set_component_parameter_value DATA_WIDTH 512
set_component_parameter_value BURSTCOUNT_WIDTH 5
set_component_parameter_value OUTSTANDING_WIDTH 16
set_component_parameter_value QUIET_CYCLES 8
save_component

add_component vortex_reset_controller ip/pcie_ddr4_system/pcie_ddr4_system_vortex_reset_controller.ip altera_reset_controller vortex_reset_controller 19.1
load_component vortex_reset_controller
set_component_parameter_value NUM_RESET_INPUTS 1
set_component_parameter_value SYNC_DEPTH 3
set_component_parameter_value ADAPT_RESET_REQUEST 0
save_component

add_component board_manager_0 ip/pcie_ddr4_system/pcie_ddr4_system_board_manager_2.ip de10pro_board_manager board_manager_0 1.0
load_component board_manager_0
set_component_parameter_value MGMT_CLK_HZ 50000000
set_component_parameter_value TELEMETRY_POLL_CYCLES 5000000
save_component

# connections
add_connection DUT.coreclkout_hip BAR_INTERPRETER.clk clock
add_connection DUT.coreclkout_hip board_mgmt_cdc.s0_clk clock
add_connection DUT.coreclkout_hip ddr4_clock_crossing_bridge_ddr4a.s0_clk clock
add_connection DUT.coreclkout_hip ddr4_ingress_pipe_ddr4a.clk clock
add_connection DUT.coreclkout_hip DMA_CONTROLLER.clk clock
add_connection DUT.coreclkout_hip MEM.clk1 clock
add_connection DUT.coreclkout_hip vortex_ctrl_cdc.s0_clk clock
add_connection DUT.coreclkout_hip vortex_mem_cdc.m0_clk clock
add_connection DUT.coreclkout_hip vortex_mem_drain_0.clock clock
add_connection emif_s10_ddr4a.emif_usr_clk ddr4_clock_crossing_bridge_ddr4a.m0_clk clock
add_connection emif_s10_ddr4a.emif_usr_clk ddr4_pipe_ddr4a_0.clk clock
add_connection emif_s10_ddr4a.emif_usr_clk ddr4_pipe_ddr4a_1.clk clock
add_connection mgmt_clk_bridge.out_clk board_manager_0.clock clock
add_connection mgmt_clk_bridge.out_clk board_mgmt_cdc.m0_clk clock
add_connection mgmt_clk_bridge.out_clk mgmt_reset_bridge.clk clock
add_connection mgmt_clk_bridge.out_clk vortex_iopll_reconfig.mgmt_clk clock
add_connection pll_ref_clk_bridge.out_clk pll_ref_reset_bridge.clk clock
add_connection pll_ref_clk_bridge.out_clk vortex_iopll.refclk clock
add_connection vortex_iopll.outclk0 board_manager_0.vortex_clock clock
add_connection vortex_iopll.outclk0 vortex_ctrl_cdc.m0_clk clock
add_connection vortex_iopll.outclk0 vortex_mem_cdc.s0_clk clock
add_connection vortex_iopll.outclk0 vortex_reset_controller.clk clock
add_connection vortex_iopll.outclk0 vortex_shell_0.clock clock
add_connection DUT.app_nreset_status BAR_INTERPRETER.reset reset
add_connection DUT.app_nreset_status board_mgmt_cdc.s0_reset reset
add_connection DUT.app_nreset_status ddr4_clock_crossing_bridge_ddr4a.s0_reset reset
add_connection DUT.app_nreset_status ddr4_ingress_pipe_ddr4a.reset reset
add_connection DUT.app_nreset_status DMA_CONTROLLER.reset reset
add_connection DUT.app_nreset_status MEM.reset1 reset
add_connection DUT.app_nreset_status vortex_ctrl_cdc.s0_reset reset
add_connection DUT.app_nreset_status vortex_mem_cdc.m0_reset reset
add_connection DUT.app_nreset_status vortex_mem_drain_0.reset reset
add_connection emif_s10_ddr4a.emif_usr_reset_n ddr4_clock_crossing_bridge_ddr4a.m0_reset reset
add_connection emif_s10_ddr4a.emif_usr_reset_n ddr4_pipe_ddr4a_0.reset reset
add_connection emif_s10_ddr4a.emif_usr_reset_n ddr4_pipe_ddr4a_1.reset reset
add_connection mgmt_reset_bridge.out_reset board_manager_0.reset reset
add_connection mgmt_reset_bridge.out_reset board_mgmt_cdc.m0_reset reset
add_connection mgmt_reset_bridge.out_reset vortex_iopll_reconfig.mgmt_reset reset
add_connection pll_ref_reset_bridge.out_reset vortex_iopll.reset reset
add_connection vortex_reset_controller.reset_out vortex_ctrl_cdc.m0_reset reset
add_connection vortex_reset_controller.reset_out vortex_mem_cdc.s0_reset reset
add_connection vortex_reset_controller.reset_out vortex_shell_0.reset reset
add_connection BAR_INTERPRETER.bri_master board_mgmt_cdc.s0 avalon
set_connection_parameter_value BAR_INTERPRETER.bri_master/board_mgmt_cdc.s0 baseAddress 0x2000
add_connection BAR_INTERPRETER.bri_master DMA_CONTROLLER.dma_slave avalon
set_connection_parameter_value BAR_INTERPRETER.bri_master/DMA_CONTROLLER.dma_slave baseAddress 0x0000
add_connection BAR_INTERPRETER.bri_master MEM.s1 avalon
set_connection_parameter_value BAR_INTERPRETER.bri_master/MEM.s1 baseAddress 0x00020000
add_connection BAR_INTERPRETER.bri_master MEM.s2 avalon
set_connection_parameter_value BAR_INTERPRETER.bri_master/MEM.s2 baseAddress 0x00028000
add_connection BAR_INTERPRETER.bri_master vortex_ctrl_cdc.s0 avalon
set_connection_parameter_value BAR_INTERPRETER.bri_master/vortex_ctrl_cdc.s0 baseAddress 0x1000
add_connection board_manager_0.reconfig vortex_iopll_reconfig.mgmt_avalon_slave avalon
set_connection_parameter_value board_manager_0.reconfig/vortex_iopll_reconfig.mgmt_avalon_slave baseAddress 0x0000
add_connection board_mgmt_cdc.m0 board_manager_0.csr avalon
set_connection_parameter_value board_mgmt_cdc.m0/board_manager_0.csr baseAddress 0x0000
add_connection ddr4_clock_crossing_bridge_ddr4a.m0 ddr4_pipe_ddr4a_0.s0 avalon
set_connection_parameter_value ddr4_clock_crossing_bridge_ddr4a.m0/ddr4_pipe_ddr4a_0.s0 baseAddress 0x0000
add_connection ddr4_ingress_pipe_ddr4a.m0 ddr4_clock_crossing_bridge_ddr4a.s0 avalon
set_connection_parameter_value ddr4_ingress_pipe_ddr4a.m0/ddr4_clock_crossing_bridge_ddr4a.s0 baseAddress 0x0000
add_connection ddr4_pipe_ddr4a_0.m0 ddr4_pipe_ddr4a_1.s0 avalon
set_connection_parameter_value ddr4_pipe_ddr4a_0.m0/ddr4_pipe_ddr4a_1.s0 baseAddress 0x0000
add_connection ddr4_pipe_ddr4a_1.m0 emif_s10_ddr4a.ctrl_amm_0 avalon
set_connection_parameter_value ddr4_pipe_ddr4a_1.m0/emif_s10_ddr4a.ctrl_amm_0 baseAddress 0x0000
add_connection DUT.bam_master BAR_INTERPRETER.bri_slave avalon
set_connection_parameter_value DUT.bam_master/BAR_INTERPRETER.bri_slave baseAddress 0x0000
add_connection DUT.rddm_master ddr4_ingress_pipe_ddr4a.s0 avalon
set_connection_parameter_value DUT.rddm_master/ddr4_ingress_pipe_ddr4a.s0 baseAddress 0x0000000800000000
add_connection DUT.rddm_master DMA_CONTROLLER.dma_slave avalon
set_connection_parameter_value DUT.rddm_master/DMA_CONTROLLER.dma_slave baseAddress 0x0000
add_connection DUT.rddm_master MEM.s2 avalon
set_connection_parameter_value DUT.rddm_master/MEM.s2 baseAddress 0x00010000
add_connection DUT.wrdm_master ddr4_ingress_pipe_ddr4a.s0 avalon
set_connection_parameter_value DUT.wrdm_master/ddr4_ingress_pipe_ddr4a.s0 baseAddress 0x0000000800000000
add_connection DUT.wrdm_master MEM.s1 avalon
set_connection_parameter_value DUT.wrdm_master/MEM.s1 baseAddress 0x00010000
add_connection vortex_ctrl_cdc.m0 vortex_shell_0.ctrl avalon
set_connection_parameter_value vortex_ctrl_cdc.m0/vortex_shell_0.ctrl baseAddress 0x0000
add_connection vortex_mem_cdc.m0 vortex_mem_drain_0.s0 avalon
set_connection_parameter_value vortex_mem_cdc.m0/vortex_mem_drain_0.s0 baseAddress 0x0000
add_connection vortex_mem_drain_0.m0 ddr4_ingress_pipe_ddr4a.s0 avalon
set_connection_parameter_value vortex_mem_drain_0.m0/ddr4_ingress_pipe_ddr4a.s0 baseAddress 0x0000
add_connection vortex_shell_0.avalon_master vortex_mem_cdc.s0 avalon
set_connection_parameter_value vortex_shell_0.avalon_master/vortex_mem_cdc.s0 baseAddress 0x0000
add_connection DMA_CONTROLLER.rddm_desc DUT.rddm_desc avalon_streaming
add_connection DMA_CONTROLLER.rddm_prio DUT.rddm_prio avalon_streaming
add_connection DMA_CONTROLLER.wrdm_desc DUT.wrdm_desc avalon_streaming
add_connection DMA_CONTROLLER.wrdm_prio DUT.wrdm_prio avalon_streaming
add_connection DUT.rddm_tx DMA_CONTROLLER.rddm_tx avalon_streaming
add_connection DUT.wrdm_tx DMA_CONTROLLER.wrdm_tx avalon_streaming
add_connection board_manager_0.clock_control vortex_shell_0.clock_control conduit
add_connection board_manager_0.memory_drain vortex_mem_drain_0.drain conduit
add_connection DUT.bam_conduit BAR_INTERPRETER.bri_conduit conduit
add_connection DUT.rddm_conduit DMA_CONTROLLER.rddm_conduit conduit
add_connection DUT.wrdm_conduit DMA_CONTROLLER.wrdm_conduit conduit
add_connection vortex_iopll.locked board_manager_0.pll_status conduit
add_connection vortex_iopll.reconfig_from_pll vortex_iopll_reconfig.reconfig_from_pll conduit
add_connection vortex_iopll.reconfig_to_pll vortex_iopll_reconfig.reconfig_to_pll conduit

# exported interfaces
add_interface board_management conduit end
set_interface_property board_management EXPORT_OF board_manager_0.board_io
add_interface emif_s10_ddr4a_local_reset_req conduit end
set_interface_property emif_s10_ddr4a_local_reset_req EXPORT_OF emif_s10_ddr4a.local_reset_req
add_interface emif_s10_ddr4a_local_reset_status conduit end
set_interface_property emif_s10_ddr4a_local_reset_status EXPORT_OF emif_s10_ddr4a.local_reset_status
add_interface emif_s10_ddr4a_mem conduit end
set_interface_property emif_s10_ddr4a_mem EXPORT_OF emif_s10_ddr4a.mem
add_interface emif_s10_ddr4a_oct conduit end
set_interface_property emif_s10_ddr4a_oct EXPORT_OF emif_s10_ddr4a.oct
add_interface emif_s10_ddr4a_pll_ref_clk clock sink
set_interface_property emif_s10_ddr4a_pll_ref_clk EXPORT_OF emif_s10_ddr4a.pll_ref_clk
add_interface emif_s10_ddr4a_status conduit end
set_interface_property emif_s10_ddr4a_status EXPORT_OF emif_s10_ddr4a.status
add_interface hip_ctrl conduit end
set_interface_property hip_ctrl EXPORT_OF DUT.hip_ctrl
add_interface mgmt_clk_50_b2c clock sink
set_interface_property mgmt_clk_50_b2c EXPORT_OF mgmt_clk_bridge.in_clk
add_interface mgmt_reset_req reset sink
set_interface_property mgmt_reset_req EXPORT_OF mgmt_reset_bridge.in_reset
add_interface pcie_rstn conduit end
set_interface_property pcie_rstn EXPORT_OF DUT.npor
add_interface pipe_sim_only conduit end
set_interface_property pipe_sim_only EXPORT_OF DUT.hip_pipe
add_interface pll_ref_reset_req reset sink
set_interface_property pll_ref_reset_req EXPORT_OF pll_ref_reset_bridge.in_reset
add_interface refclk clock sink
set_interface_property refclk EXPORT_OF DUT.refclk
add_interface vortex_refclk_50_b3i clock sink
set_interface_property vortex_refclk_50_b3i EXPORT_OF pll_ref_clk_bridge.in_clk
add_interface vortex_reset_req reset sink
set_interface_property vortex_reset_req EXPORT_OF vortex_reset_controller.reset_in0
add_interface xcvr conduit end
set_interface_property xcvr EXPORT_OF DUT.hip_serial

save_system pcie_ddr4_system.qsys
